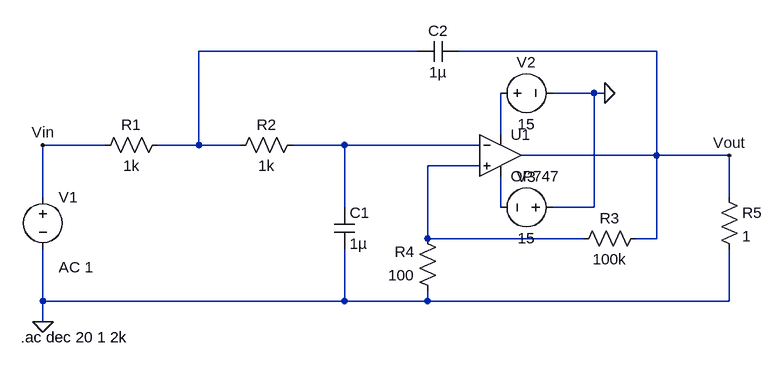
[diagram p0: schematic RC_Active Cascaded Bandpass Filter.asc]
RC_Active Cascaded Bandpass Filter.asc, the LTspice schematic file:
Version 4
SHEET 1 1144 680
WIRE 592 -80 256 -80
WIRE 960 -80 656 -80
WIRE 864 -16 800 -16
WIRE 880 -16 864 -16
WIRE 720 48 720 -16
WIRE 112 64 16 64
WIRE 256 64 256 -80
WIRE 256 64 192 64
WIRE 320 64 256 64
WIRE 480 64 400 64
WIRE 688 64 480 64
WIRE 960 80 960 -80
WIRE 960 80 752 80
WIRE 1072 80 960 80
WIRE 688 96 608 96
WIRE 16 144 16 64
WIRE 1072 144 1072 80
WIRE 480 160 480 64
WIRE 720 160 720 112
WIRE 864 160 864 -16
WIRE 864 160 800 160
WIRE 608 208 608 96
WIRE 848 208 608 208
WIRE 960 208 960 80
WIRE 960 208 928 208
WIRE 16 304 16 224
WIRE 480 304 480 224
WIRE 480 304 16 304
WIRE 608 304 608 288
WIRE 608 304 480 304
WIRE 1072 304 1072 224
WIRE 1072 304 608 304
WIRE 16 336 16 304
FLAG 16 336 0
FLAG 880 -16 0
FLAG 1072 80 Vout
FLAG 16 64 Vin
SYMBOL voltage 16 128 R0
WINDOW 123 24 124 Left 2
WINDOW 39 0 0 Left 0
SYMATTR InstName V1
SYMATTR Value ""
SYMATTR Value2 AC 1
SYMBOL res 208 48 R90
WINDOW 0 0 56 VBottom 2
WINDOW 3 32 56 VTop 2
SYMATTR InstName R1
SYMATTR Value 1k
SYMBOL res 416 48 R90
WINDOW 0 0 56 VBottom 2
WINDOW 3 32 56 VTop 2
SYMATTR InstName R2
SYMATTR Value 1k
SYMBOL res 944 192 R90
WINDOW 0 0 56 VBottom 2
WINDOW 3 32 56 VTop 2
SYMATTR InstName R3
SYMATTR Value 100k
SYMBOL res 624 304 R180
WINDOW 0 36 76 Left 2
WINDOW 3 36 40 Left 2
SYMATTR InstName R4
SYMATTR Value 100
SYMBOL cap 464 160 R0
SYMATTR InstName C1
SYMATTR Value 1µ
SYMBOL cap 656 -96 R90
WINDOW 0 0 32 VBottom 2
WINDOW 3 32 32 VTop 2
SYMATTR InstName C2
SYMATTR Value 1µ
SYMBOL OpAmps\\OP747 720 16 R0
SYMATTR InstName U1
SYMBOL voltage 704 -16 R270
WINDOW 0 32 56 VTop 2
WINDOW 3 -32 56 VBottom 2
WINDOW 123 0 0 Left 0
WINDOW 39 0 0 Left 0
SYMATTR InstName V2
SYMATTR Value 15
SYMBOL voltage 816 160 R90
WINDOW 0 -32 56 VBottom 2
WINDOW 3 32 56 VTop 2
WINDOW 123 0 0 Left 0
WINDOW 39 0 0 Left 0
SYMATTR InstName V3
SYMATTR Value 15
SYMBOL res 1056 128 R0
SYMATTR InstName R5
SYMATTR Value 1
TEXT -18 360 Left 2 !.ac dec 20 1 2k

The netlist it stands for:
* RC_Active Cascaded Bandpass Filter.asc
V1 Vin 0 AC 1
R1 N001 Vin 1k
R2 N003 N001 1k
R3 Vout N004 100k
R4 0 N004 100
C1 N003 0 1µ
C2 Vout N001 1µ
XU1 N004 N003 N002 N005 Vout OP747  ; pins In+ In- V+ V- OUT
V2 N002 0 15
V3 0 N005 15
R5 Vout 0 1
.ac dec 20 1 2k
.backanno
.end